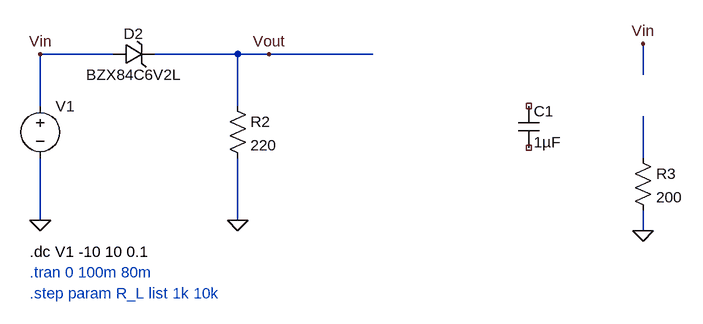
[diagram p0: schematic lab1part3.asc]
* lab1part3.asc
V1 Vin 0
R2 Vout 0 220
R3 N001 0 200
D2 Vin Vout BZX84C6V2L
C1 NC_01 NC_02 1µF
.model D D
.lib standard.dio
.dc V1 -10 10 0.1
* .tran 0 100m 80m
* .step param R_L list 1k 10k
.backanno
.end

* Results of the author's LTspice run, read from the files saved beside the schematic
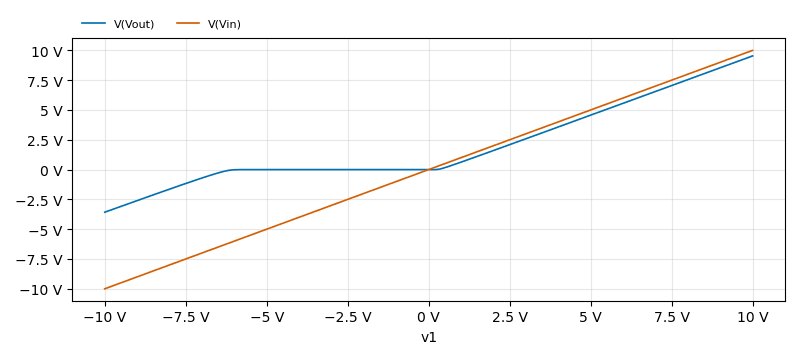
[diagram p1: DC transfer characteristic of lab1part3.asc, plotted from the saved traces]
* DC transfer characteristic, 1 run:
*   V(Vout): -3.576 V at v1=-10 V, 9.534 V at v1=10 V, min -3.576 V, max 9.534 V
*   V(Vin): -10 V at v1=-10 V, 10 V at v1=10 V, min -10 V, max 10 V